# EAGLE design PCM2707_DAC (EAGLE 7.7.0)
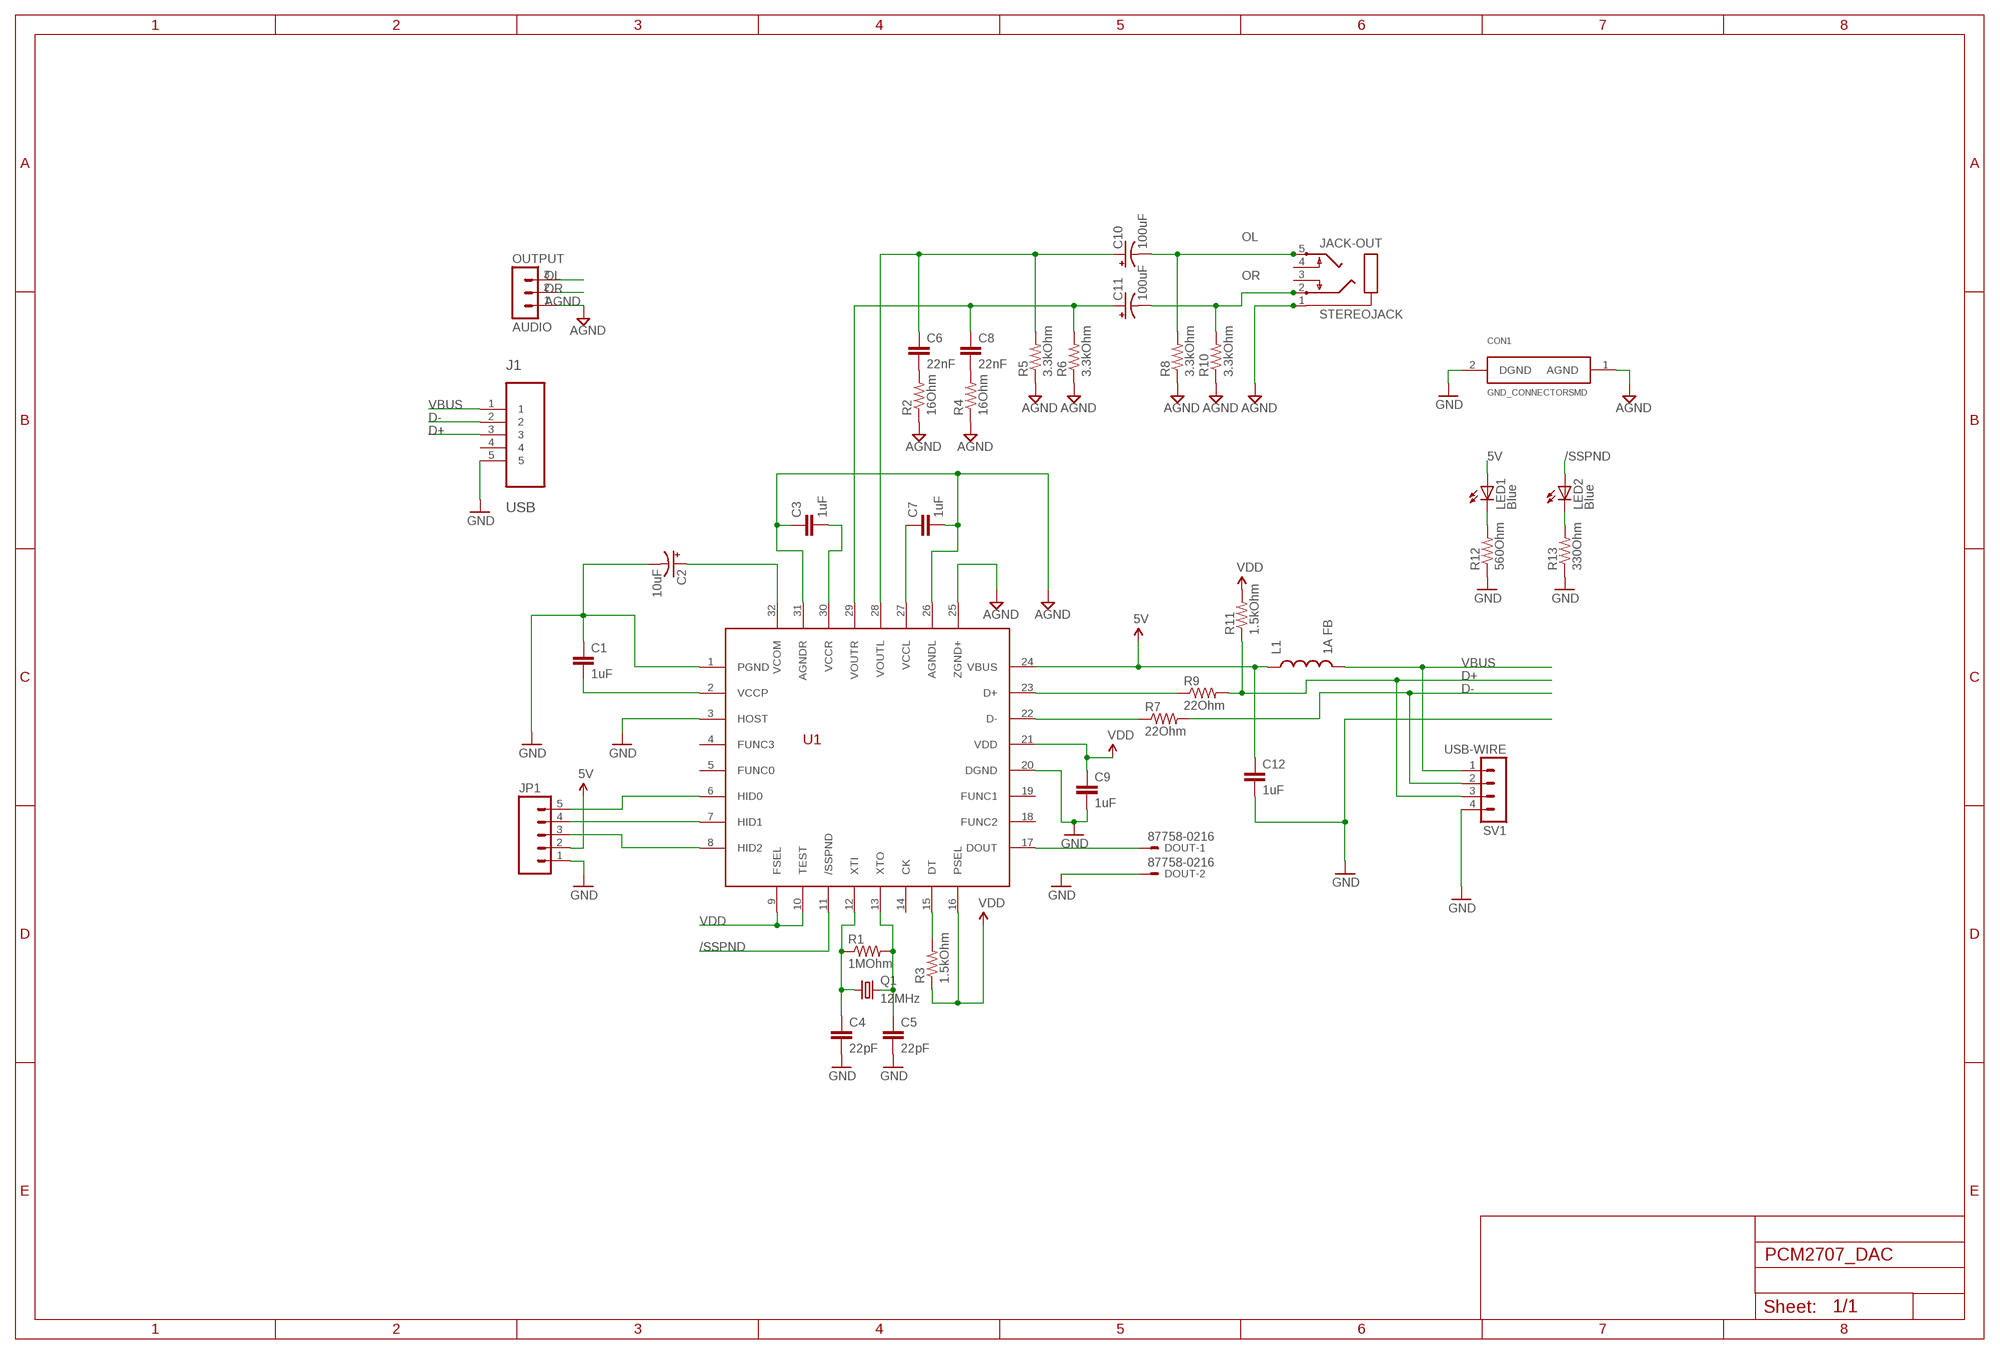
[diagram p0: schematic, sheet 1]

## Parts
C1  1uF  CAP0805  [0805]
C2  10uF  CAP_POLC  [PANASONIC_C]
C3  1uF  CAP0805  [0805]
C4  22pF  CAP0805  [0805]
C5  22pF  CAP0805  [0805]
C6  22nF  CAP1210  [1210]
C7  1uF  CAP0805  [0805]
C8  22nF  CAP1210  [1210]
C9  1uF  CAP0805  [0805]
C10  100uF  CAP_POLD  [PANASONIC_D]
C11  100uF  CAP_POLD  [PANASONIC_D]
C12  1uF  CAP0805  [0805]
CON1  GND_CONNECTORSMD  [GND_CONNECTOR]
DOUT  87758-0216  [87758-0216]
J1  USB  47346-0001  [MOLEX_47346-0001]
JACK-OUT  STEREOJACK  [STX3100]
JP1  M05LOCK  [1X05_LOCK]
L1  1A FB  INDUCTOR0805  [0805]
LED1  Blue  LED0603  [LED-0603]
LED2  Blue  LED0603  [LED-0603]
OUTPUT  AUDIO  MA03-1  [MA03-1]
Q1  12MHz  CRYSTALHC49U-V  [HC49U-V]
R1  1MOhm  RESISTOR0805-RES  [0805]
R2  16Ohm  RESISTOR0805-RES  [0805]
R3  1.5kOhm  RESISTOR0805-RES  [0805]
R4  16Ohm  RESISTOR0805-RES  [0805]
R5  3.3kOhm  RESISTOR0805-RES  [0805]
R6  3.3kOhm  RESISTOR0805-RES  [0805]
R7  22Ohm  RESISTOR0805-RES  [0805]
R8  3.3kOhm  RESISTOR0805-RES  [0805]
R9  22Ohm  RESISTOR0805-RES  [0805]
R10  3.3kOhm  RESISTOR0805-RES  [0805]
R11  1.5kOhm  RESISTOR0805-RES  [0805]
R12  560Ohm  RESISTOR0805-RES  [0805]
R13  330Ohm  RESISTOR0805-RES  [0805]
SV1  USB-WIRE  MA04-1  [MA04-1]
U1  PCM2707C_TQFP32"  [32TQFP_PCM2707C]

## Nets
5V: C12.1 JP1.2 L1.1 LED1.A U1.24(VBUS)
/SSPND: LED2.A U1.11(/SSPND)
AGND: C3.1 C7.2 CON1.1(AGND) JACK-OUT.1 OUTPUT.1 R2.1 R4.1 R5.1 R6.1 R8.1 R10.1 U1.25(ZGND+) U1.26(AGNDL) U1.31(AGNDR)
D+: J1.3 R9.2 R11.1 SV1.3
D-: J1.2 R7.2 SV1.2
GND: C1.1 C2.- C4.2 C5.2 C9.2 C12.2 CON1.2(DGND) DOUT.2 J1.5 JP1.1 R12.1 R13.1 SV1.4 U1.1(PGND) U1.3(HOST) U1.20(DGND)
N$1: JP1.5 U1.6(HID0)
N$2: C1.2 U1.2(VCCP)
N$3: JP1.4 U1.7(HID1)
N$4: C2.+ U1.32(VCOM)
N$5: JP1.3 U1.8(HID2)
N$6: DOUT.1 U1.17(DOUT)
N$7: C4.1 Q1.1 R1.1 U1.12(XTI)
N$8: C5.1 Q1.2 R1.2 U1.13(XTO)
N$9: R9.1 U1.23(D+)
N$10: R7.1 U1.22(D-)
N$13: C3.2 U1.30(VCCR)
N$14: LED1.C R12.2
N$15: R3.2 U1.15(DT)
N$16: C7.1 U1.27(VCCL)
N$17: C8.2 R4.2
N$18: C6.2 R2.2
N$21: C8.1 C11.+ R6.2 U1.29(VOUTR)
N$22: LED2.C R13.2
N$23: C6.1 C10.+ R5.2 U1.28(VOUTL)
OL: C10.- JACK-OUT.5 OUTPUT.3 R8.2
OR: C11.- JACK-OUT.2 OUTPUT.2 R10.2
VBUS: J1.1 L1.2 SV1.1
VDD: C9.1 R3.1 R11.2 U1.9(FSEL) U1.10(TEST) U1.16(PSEL) U1.21(VDD)
Unconnected: J1.4 JACK-OUT.3 JACK-OUT.4 U1.4(FUNC3) U1.5(FUNC0) U1.14(CK) U1.18(FUNC2) U1.19(FUNC1)

## Library data of the parts
C1 C3-C9 C12 = SparkFun-Passives:CAP: Capacitor Standard 0603 ceramic capacitor, and 0.1" leaded capacitor.
C2 C10 C11 = SparkFun-Passives:CAP_POL: Capacitor Polarized These are standard SMD and PTH capacitors. Normally 10uF, 47uF, and 100uF in electrolytic and tantalum varieties. Always verify the external diameter of the through hole cap, it varies with capacity, voltage, and manufacturer. The EIA devices should be standard.
CON1 = lowderlib:GND_CONNECTOR
DOUT = con-molex:87758-0216: 2 Pin - 2mm Dual Row Single Wafer, Vertical T/H HDR Source: http://www.molex.com/pdm_docs/sd/877580616_sd.pdf; MPN: 87758-0216; OC_FARNELL: unknown; OC_NEWARK: 94M1513
J1 = Molex-47346-0001:47346-0001: CONN RCPT 5POS MICRO USB R/A SMD; MPN: 47346-0001; OC_FARNELL: 1568026; OC_NEWARK: 47M0505; PACKAGE: 5 POS MICRO USB R/A; SUPPLIER: MOLEX
JACK-OUT = akafugu:STEREOJACK: MIC/HEADPHONE JACK Stereo jack with two switches. Kycon STX3100, CUI SJ1-3555NG and/or 4UCon 05544
JP1 = SparkFun-Connectors:M05: Header 5 Standard 5-pin 0.1" header. Use with straight break away headers (SKU : PRT-00116), right angle break away headers (PRT-00553), swiss pins (PRT-00743), machine pins (PRT-00117), and female headers (PRT-00115). Molex polarized connector foot print use with SKU : PRT-08230 with associated crimp pins and housings.
L1 = SparkFun-Passives:INDUCTOR: Inductors Basic Inductor/Choke - 0603 and 1206. Footprints are not proven and vary greatly between part numbers. SRN6045- 33uH, 20% 1.4A SDR0403-560KL - 56uH, 10%, 500mA RMS/740mA peak
LED1 LED2 = SparkFun-LED:LED: LEDs Standard schematic elements and footprints for 5mm, 3mm, 1206, and 0603 sized LEDs. 5mm - Spark Fun Electronics SKU : COM-00529 (and others)
OUTPUT = con-lstb:MA03-1: PIN HEADER; OC_FARNELL: unknown; OC_NEWARK: unknown
Q1 = crystal:CRYSTAL: CRYSTAL; OC_FARNELL: 1666969; OC_NEWARK: unknown
R1-R13 = SparkFun-Passives:RESISTOR: Resistor Basic schematic elements and footprints for 0603, 1206, and PTH resistors.
SV1 = con-lstb:MA04-1: PIN HEADER; OC_FARNELL: unknown; OC_NEWARK: unknown
U1 = lowderlib:PCM2707C_TQFP32: Stereo Audio DAC with USB Interface, Single-Ended Headphone Output, and S/PDIF Output

## Net classes
0 default: width 0.254 mm, drill 0.305 mm, clearance 0.152 mm

## Board
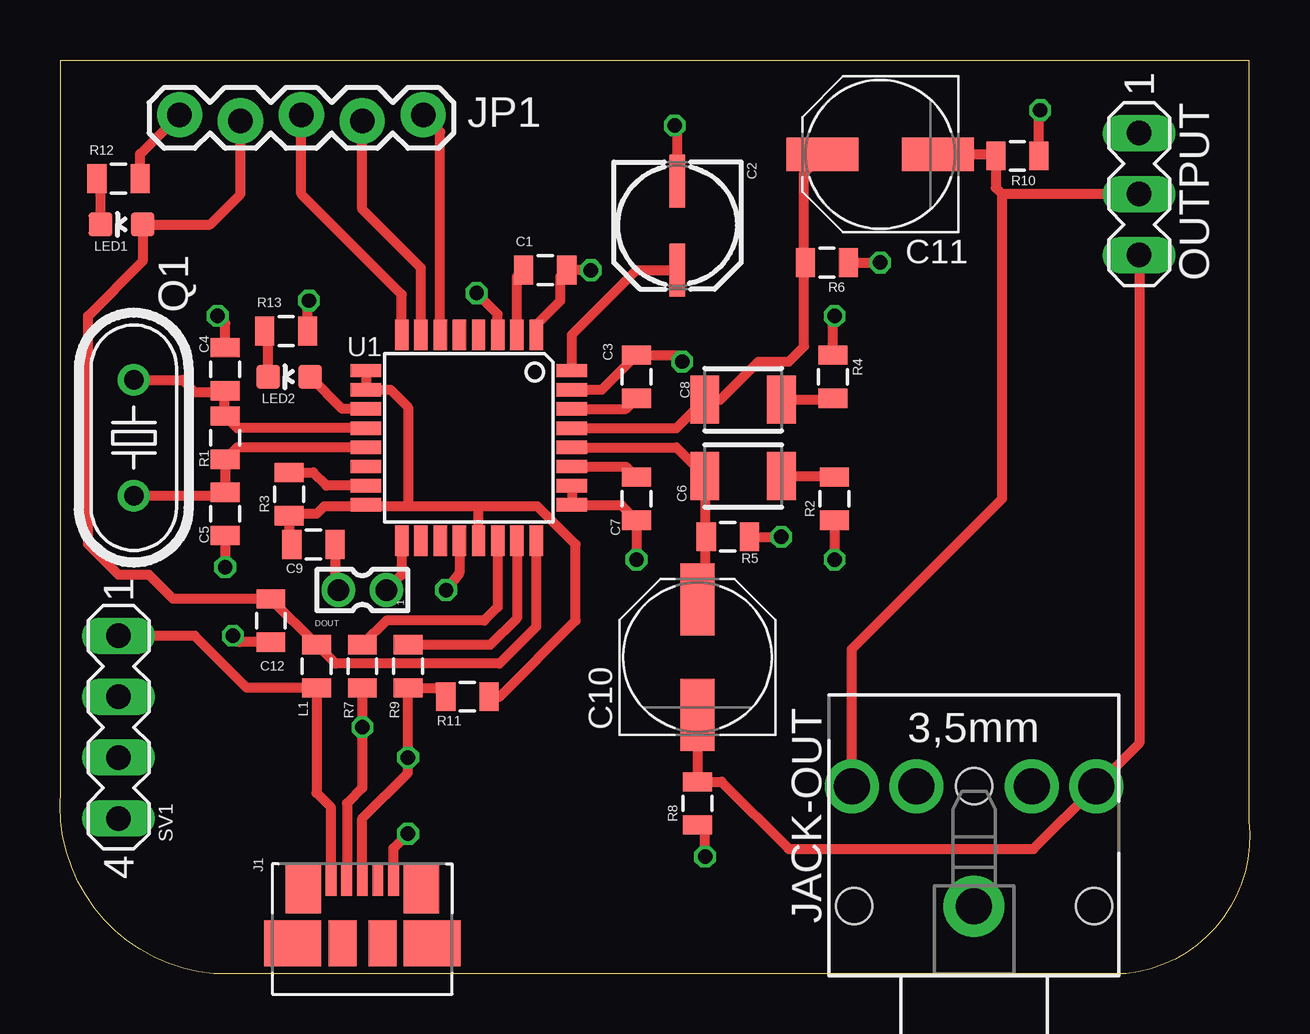
[diagram p1: board, top side]
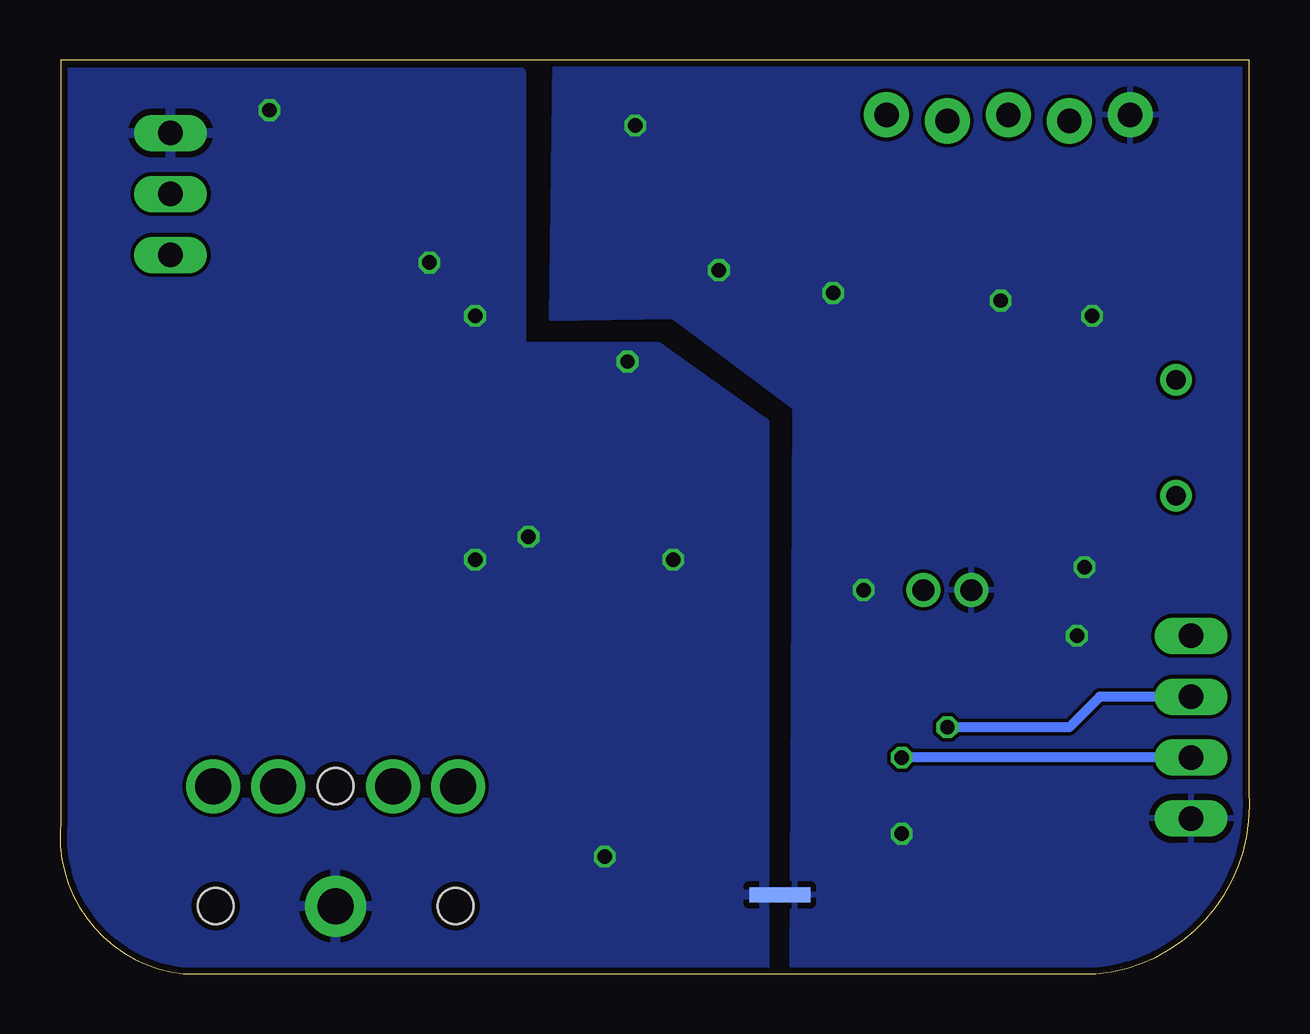
[diagram p2: board, bottom side, seen from below]

Size 49.59 x 38.1 mm. Coordinates in mm from the lower left corner, seen from the top.
Outline: 49.56,38.1 49.56,6.38 arc-90 44.45,0 6.41,0 arc-90 0.03,7.65 0.03,38.1 49.56,38.1
Copper layers (1*16): Top 0.035mm / dielectric 1.5mm / Bottom 0.035mm
Design rules "SeeedStudio_2layer_DRU_no_angle_20140221": minimum track width 6mil, minimum drill 12mil, track to track 6mil, track to pad 6mil, pad to pad 6mil, via to via 6mil, smd to smd 0mil, copper to edge 10mil, drill to drill 10mil, minimum pad ring 10mil, minimum via ring 6mil, stop-mask expansion 2mil, vias tented up to drill 100mil, thermal gap 10mil

### Footprints (pad centres in the part's own frame; a part is rotated, then mirrored left to right if it is on the bottom)
0805 = smd 0.8 x 1.2: 1 -0.9,0; 2 0.9,0
PANASONIC_C = smd 2.2 x 0.65: + 1.9,-0.2; - -1.8,-0.2
1210 = smd 1.2 x 2: 1 -1.6,0; 2 1.6,0
PANASONIC_D = smd 3 x 1.4: + 2.4,0; - -2.4,0
GND_CONNECTOR = smd 1.27 x 0.635: 1 -1.27,0; 2 0,0
87758-0216 = drill 0.9 pad 1.27: 1 0,-1; 2 0,1
MOLEX_47346-0001 = smd 0.45 x 1.38: 1 -1.3,0; 2 -0.65,0; 3 0,0; 4 0.65,0; 5 1.3,0 | smd 1.475 x 2.1: M1 -2.462,-0.36; M2 2.462,-0.36 | smd 2.375 x 1.9: M3 -2.913,-2.66; M6 2.913,-2.66 | smd 1.175 x 1.9: M4 -0.82,-2.66; M5 0.85,-2.66
STX3100 = drill 1.5 pad 2.54: 1 2.7,-0.1 | drill 1.5: 2 7.7,5; 3 7.7,2.3; 4 7.7,-2.5; 5 7.7,-5.2 | hole 1.5: 2.7,4.9; 2.7,-5.1; 7.7,-0.1
1X05_LOCK = drill 1.016 pad 1.88: 1 0,0.127; 2 2.54,-0.127; 3 5.08,0.127; 4 7.62,-0.127; 5 10.16,0.127
LED-0603 = smd 1 x 1: A 0,-0.877; C 0,0.877
MA03-1 = drill 1.016 long: 1 -2.54,0; 2 0,0; 3 2.54,0
HC49U-V = drill 0.813: 1 -2.413,0; 2 2.413,0
MA04-1 = drill 1.016 long: 1 -3.81,0; 2 -1.27,0; 3 1.27,0; 4 3.81,0
32TQFP_PCM2707C = smd 1.27 x 0.559: 1 -4.293,2.8; 2 -4.293,2; 3 -4.293,1.2; 4 -4.293,0.4; 5 -4.293,-0.4; 6 -4.293,-1.2; 7 -4.293,-2; 8 -4.293,-2.8; 17 4.293,-2.8; 18 4.293,-2; 19 4.293,-1.2; 20 4.293,-0.4; 21 4.293,0.4; 22 4.293,1.2; 23 4.293,2; 24 4.293,2.8 | smd 0.559 x 1.27: 9 -2.8,-4.293; 10 -2,-4.293; 11 -1.2,-4.293; 12 -0.4,-4.293; 13 0.4,-4.293; 14 1.2,-4.293; 15 2,-4.293; 16 2.8,-4.293; 25 2.8,4.293; 26 2,4.293; 27 1.2,4.293; 28 0.4,4.293; 29 -0.4,4.293; 30 -1.2,4.293; 31 -2,4.293; 32 -2.8,4.293

### Placement (x,y rotation side)
C1  20.22,29.34 180 top
C2  25.94,31.24 270 top
C3  24.03,24.89 270 top
C4  6.89,25.21 90 top
C5  6.89,19.18 270 top
C6  28.48,20.76 0 top
C7  24.03,19.81 270 top
C8  28.48,23.94 0 top
C9  10.57,17.91 0 top
C10  26.57,13.21 90 top
C11  34.19,34.16 180 top
C12  8.79,14.73 270 top
CON1  18.95,3.3 0 bottom
DOUT  12.6,16 90 top
J1  12.6,3.94 0 top
JACK-OUT  38,0.13 90 top
JP1  4.98,35.69 0 top
L1  10.7,12.83 270 top
LED1  2.57,31.24 90 top
LED2  9.55,24.89 90 top
OUTPUT  44.99,32.51 270 top
Q1  3.08,22.35 270 top
R1  6.89,22.35 270 top
R2  32.29,19.81 90 top
R3  9.55,20 90 top
R4  32.22,24.89 270 top
R5  27.84,18.22 180 top
R6  31.97,29.65 180 top
R7  12.6,12.83 270 top
R8  26.57,7.11 90 top
R9  14.51,12.83 270 top
R10  39.91,34.1 180 top
R11  16.98,11.56 0 top
R12  2.44,33.15 180 top
R13  9.43,26.8 180 top
SV1  2.44,10.29 270 top
U1  17.05,22.35 270 top

### Tracks (layer width: path | path; a pad name or v marks a point on that pad's centre or on a via)
5V
  Top 0.406: JP1.2 7.52,32.51 6.25,31.24 LED1.A 3.45,29.71 1.17,27.43 1.17,17.91 2.44,16.64 3.71,16.64 4.72,15.63 C12.1 L1.1 11.48,12.94 18.32,12.94 19.85,14.47 U1.24
/SSPND
  Top 0.406: U1.11 11.77,23.55 LED2.A
AGND  (via drill 0.6)
  Top 0.406: v24.03,17.27 C7.2 23.39,19.55 U1.25 U1.26 | U1.31 22.59,24.35 C3.1 25.67,25.79 v25.94,25.53 | R5.1 v30.06,18.22 | R2.1 v32.29,17.27 | R4.1 32.22,27.37 v32.29,27.43 | R6.1 v34.19,29.65 | R10.1 40.81,35.95 v40.86,36 | v26.89,4.89 26.89,5.89 R8.1
  pour Bottom: 20.22,0.13 43.72,0.13 arc80 49.43,5.21 49.43,37.59 30.38,37.59 30.38,26.16 24.67,26.16 20.22,22.99
D+  (via drill 0.6)
  Top 0.406: R9.2 15.71,11.93 R11.1 | 14.51,10.92 R9.2 | J1.3 12.6,6.48 14.51,8.38 v14.51,9.02 R9.2
  Bottom 0.406: SV1.3 v14.51,9.02
D-  (via drill 0.6)
  Top 0.406: R7.2 v12.6,10.29 12.6,7.75 11.97,7.11 11.97,3.95 J1.2
  Bottom 0.406: SV1.2 6.25,11.56 7.52,10.29 v12.6,10.29
GND  (via drill 0.6)
  Top 0.406: U1.3 18.25,27.5 v17.36,28.38 | U1.1 19.85,27.06 20.86,28.07 20.86,29.07 C1.1 v22.13,29.34 | U1.20 16.65,16.72 v16.09,16 | R13.1 10.33,28.01 v10.38,28.07 | C4.2 6.89,27.11 v6.57,27.43 | C5.2 v6.89,16.95 | C2.- 25.74,35.25 v25.62,35.37 | R12.1 3.34,34.17 JP1.1 | C12.2 7.47,13.83 v7.2,14.1 | J1.5 13.9,5.24 v14.51,5.84 | C9.2 11.47,16.13 DOUT.2
  pour Bottom: 0.03,38.1 28.95,38.13 29.11,27.33 24.03,27.43 18.95,23.62 19.08,0 7.1,0 arc-80 0.03,5.71
N$1
  Top 0.406: U1.6 15.85,35.11 JP1.5
N$2
  Top 0.406: U1.2 19.05,29.06 C1.2
N$3
  Top 0.406: U1.7 15.05,29.43 12.6,31.88 JP1.4
N$4
  Top 0.406: U1.32 21.34,26.64 24.03,29.34 C2.+
N$5
  Top 0.406: U1.8 14.25,28.33 10.06,32.51 JP1.3
N$6
  Top 0.406: U1.17 14.25,16.65 DOUT.1
N$7
  Top 0.406: Q1.1 5.11,24.77 5.62,24.26 6.83,24.26 | 6.83,24.26 C4.1 | U1.12 7.39,22.75 R1.1 6.83,23.3 6.83,24.26
N$8
  Top 0.406: U1.13 7.39,21.95 R1.2 C5.1 6.75,19.94 Q1.2
N$9
  Top 0.406: R9.1 17.95,13.73 19.05,14.83 U1.23
N$10
  Top 0.406: U1.22 18.25,15.3 17.68,14.73 13.61,14.73 R7.1
N$13
  Top 0.406: U1.30 23.59,23.55 C3.2
N$14
  Top 0.406: LED1.C 1.69,33 R12.2
N$15
  Top 0.406: U1.15 11.11,20.35 10.56,20.9 R3.2
N$16
  Top 0.406: U1.27 23.59,21.15 C7.1
N$17
  Top 0.406: C8.2 32.17,23.94 R4.2
N$18
  Top 0.406: C6.2 32.23,20.76 R2.2
N$21
  Top 0.406: U1.29 25.69,22.75 C8.1 27.52,23.94 29.11,25.53 30.38,25.53 31.02,26.16 31.02,29.97 | R6.2 31.07,29.92 31.02,29.97 | 31.02,29.97 31.02,33.39 C11.+
N$22
  Top 0.406: LED2.C 8.68,26.65 R13.2
N$23
  Top 0.406: U1.28 25.69,21.95 C6.1 26.88,17.91 | 26.88,17.91 26.88,15.91 C10.+ | R5.2 26.94,17.97 26.88,17.91
OL
  Top 0.406: C10.- R8.2 27.58,8.01 30.38,5.21 40.58,5.21 JACK-OUT.5 44.05,8.68 44.99,9.61 OUTPUT.3
OR
  Top 0.406: C11.- 38.94,34.16 R10.2 39.01,32.78 39.27,32.51 | JACK-OUT.2 33,13.54 39.27,19.81 39.27,32.51 | OUTPUT.2 39.27,32.51
VBUS
  Top 0.406: SV1.1 5.62,14.1 7.79,11.93 L1.2 10.7,7.54 11.3,6.94 J1.1
VDD
  Top 0.406: U1.9 U1.10 13.78,24.35 14.51,23.62 14.51,19.49 | U1.21 17.45,19.41 17.36,19.49 | 17.36,19.49 14.51,19.49 | 14.51,19.49 12.81,19.49 | 12.81,19.49 U1.16 | 12.81,19.49 11.01,19.49 10.7,19.18 9.63,19.18 R3.1 9.55,18.02 C9.1 | R11.2 18.32,11.56 21.49,14.73 21.49,17.91 19.9,19.49 17.36,19.49